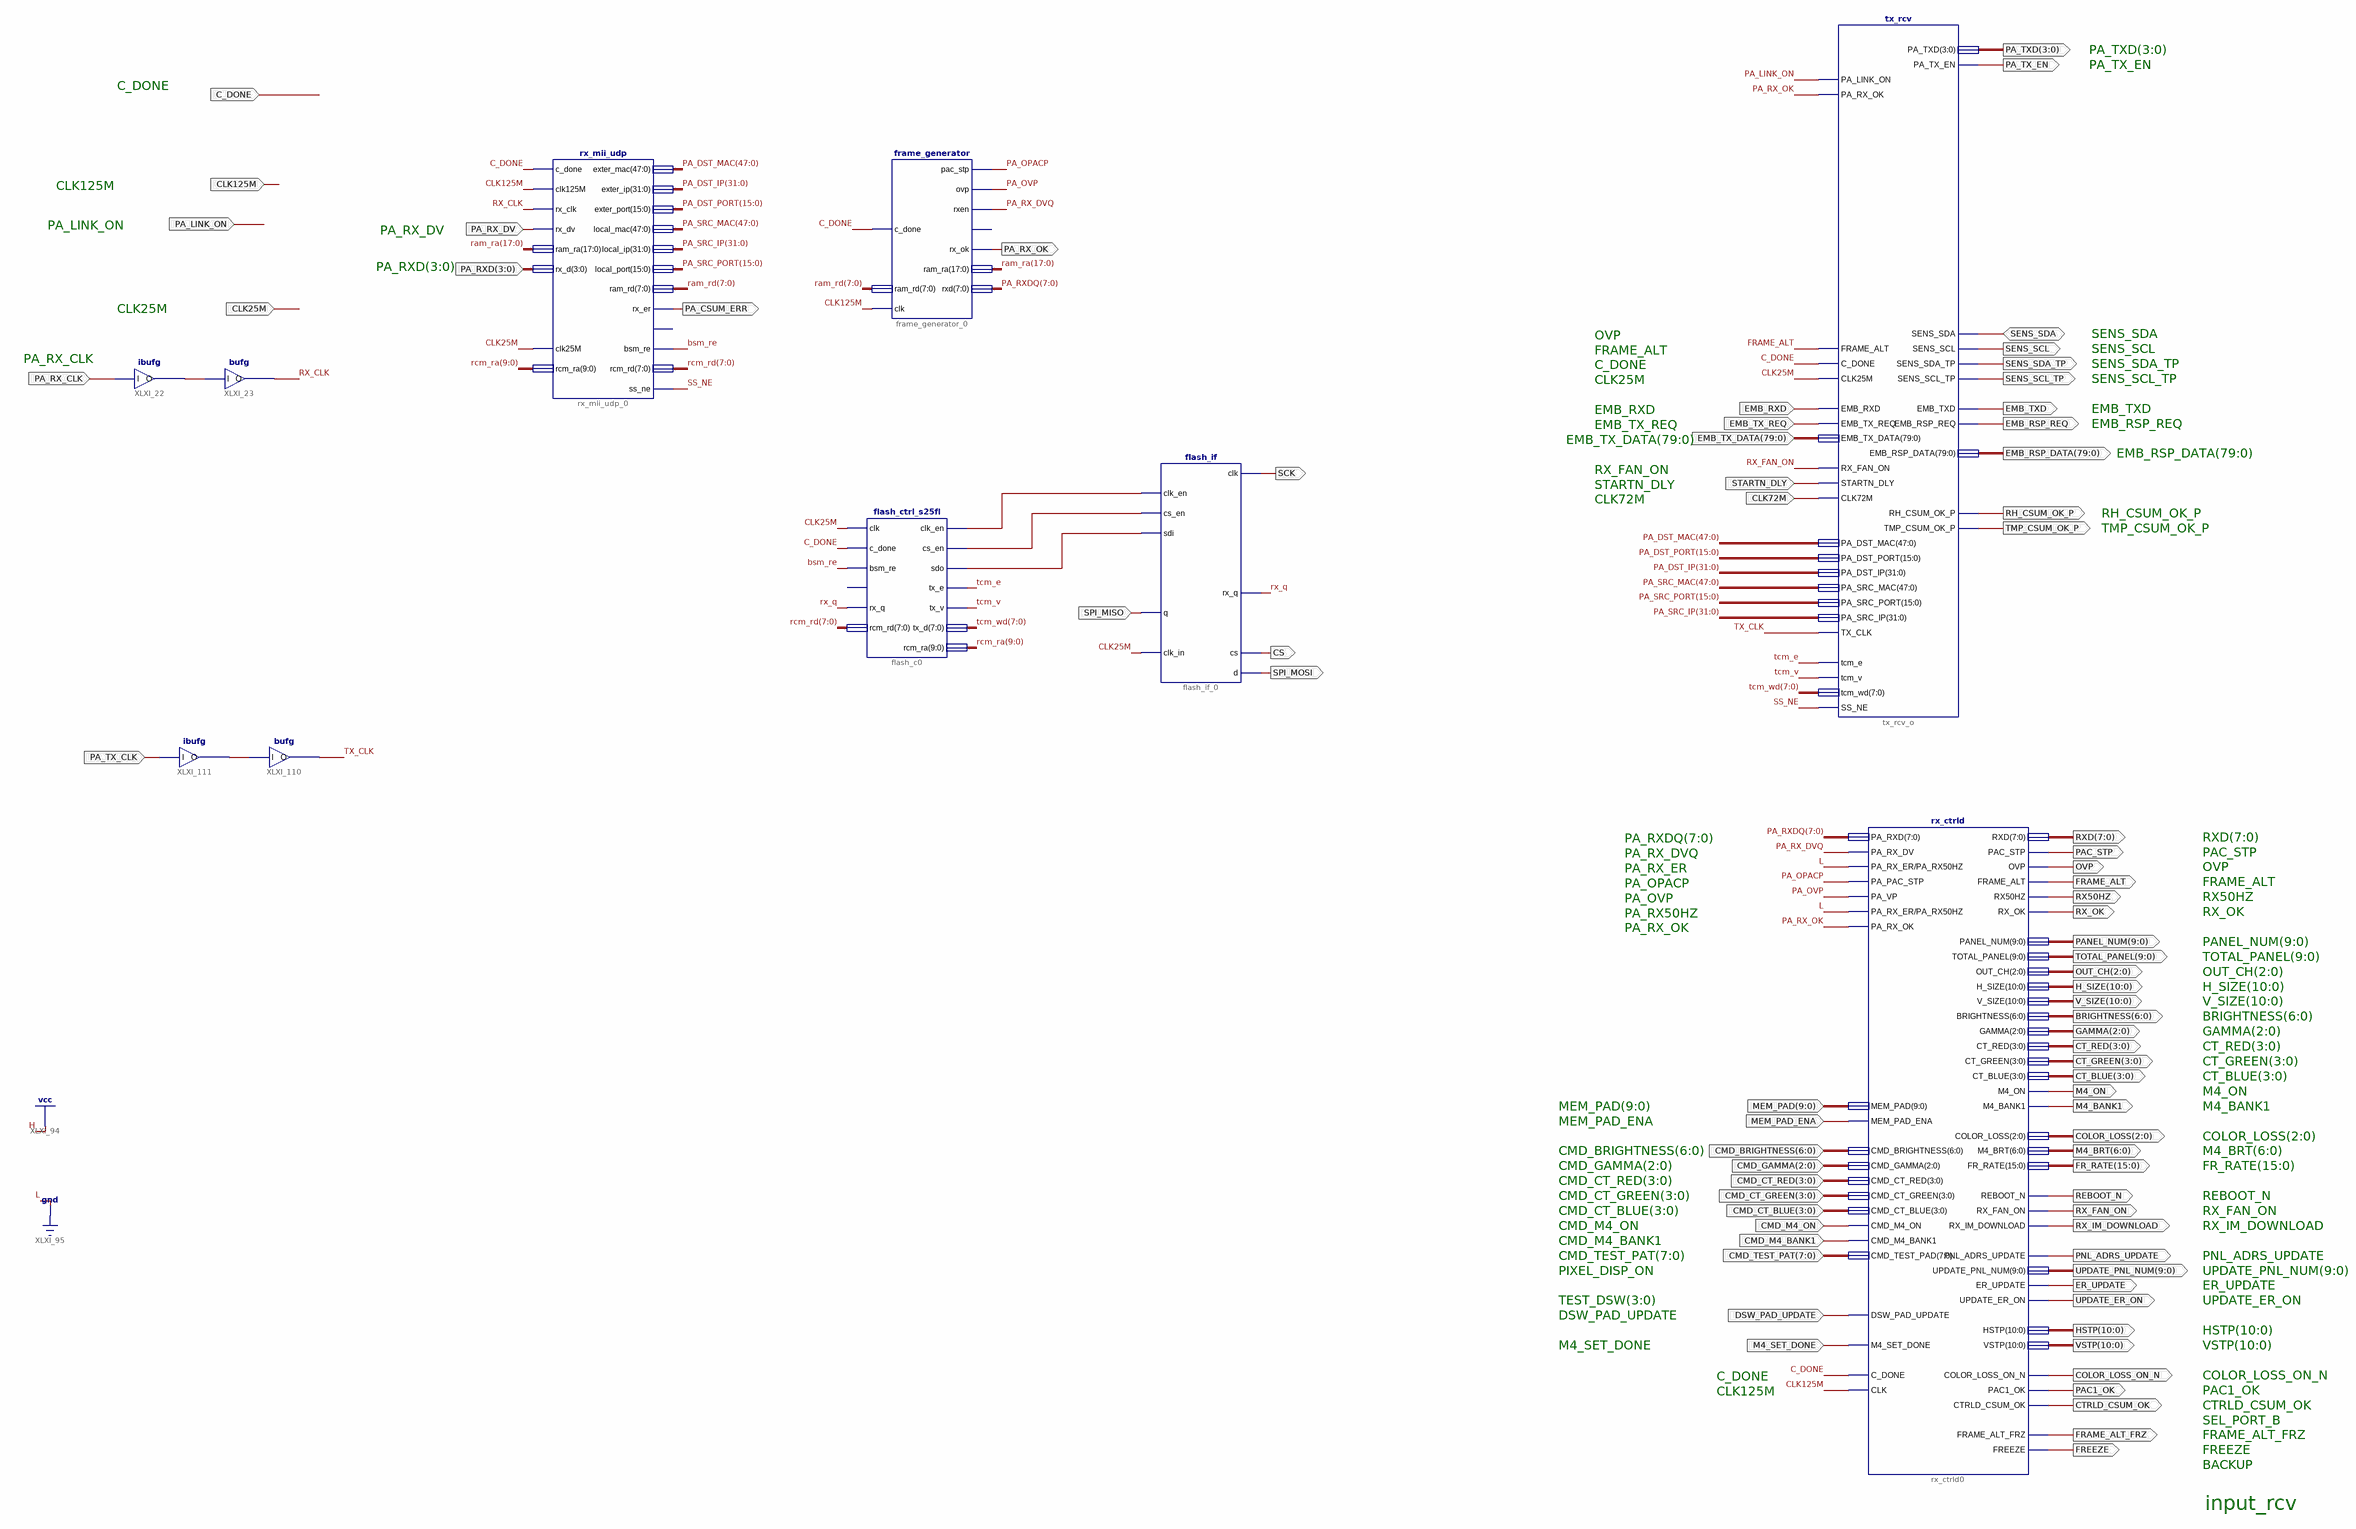
[diagram p0: schematic sheet 1]
// Xilinx ISE schematic input_rcv.sch (aspartan6) as structural Verilog: 10 symbols, 78 ports
module input_rcv (
  input  CLK125M,
  input  PA_LINK_ON,
  input  C_DONE,
  input  PA_RX_DV,
  input  CLK25M,
  input  EMB_RXD,
  input  EMB_TX_REQ,
  input  [79:0] EMB_TX_DATA,
  input  STARTN_DLY,
  input  CLK72M,
  input  [6:0] CMD_BRIGHTNESS,
  input  [9:0] MEM_PAD,
  input  MEM_PAD_ENA,
  input  [2:0] CMD_GAMMA,
  input  [3:0] CMD_CT_RED,
  input  [3:0] CMD_CT_GREEN,
  input  [3:0] CMD_CT_BLUE,
  input  CMD_M4_ON,
  input  CMD_M4_BANK1,
  input  [7:0] CMD_TEST_PAT,
  input  DSW_PAD_UPDATE,
  input  M4_SET_DONE,
  input  [3:0] PA_RXD,
  input  PA_RX_CLK,
  input  PA_TX_CLK,
  input  SPI_MISO,
  inout  SENS_SDA,
  output PA_RX_OK,
  output OVP,
  output [9:0] PANEL_NUM,
  output RX_FAN_ON,
  output FRAME_ALT,
  output [3:0] PA_TXD,
  output PA_TX_EN,
  output SENS_SCL_TP,
  output SENS_SDA_TP,
  output SENS_SCL,
  output EMB_TXD,
  output EMB_RSP_REQ,
  output [79:0] EMB_RSP_DATA,
  output TMP_CSUM_OK_P,
  output RH_CSUM_OK_P,
  output [7:0] RXD,
  output PAC_STP,
  output [9:0] UPDATE_PNL_NUM,
  output REBOOT_N,
  output RX_IM_DOWNLOAD,
  output PNL_ADRS_UPDATE,
  output ER_UPDATE,
  output UPDATE_ER_ON,
  output [10:0] HSTP,
  output [10:0] VSTP,
  output COLOR_LOSS_ON_N,
  output RX50HZ,
  output RX_OK,
  output PAC1_OK,
  output CTRLD_CSUM_OK,
  output [9:0] TOTAL_PANEL,
  output [2:0] OUT_CH,
  output [10:0] H_SIZE,
  output [10:0] V_SIZE,
  output [6:0] BRIGHTNESS,
  output [2:0] GAMMA,
  output [3:0] CT_RED,
  output [3:0] CT_GREEN,
  output [3:0] CT_BLUE,
  output M4_ON,
  output M4_BANK1,
  output [2:0] COLOR_LOSS,
  output [6:0] M4_BRT,
  output [15:0] FR_RATE,
  output FRAME_ALT_FRZ,
  output FREEZE,
  output L,
  output PA_CSUM_ERR,
  output SCK,
  output CS,
  output SPI_MOSI
);

  wire bsm_re, PA_OPACP, PA_OVP, PA_RX_DVQ, RX_CLK, rx_q, SS_NE, tcm_e, tcm_v, TX_CLK, XLXN_388, XLXN_691,
       XLXN_808, XLXN_831, XLXN_832;
  wire [7:0] PA_RXDQ, ram_rd, rcm_rd, tcm_wd;
  wire [9:0] rcm_ra;
  wire [15:0] PA_DST_PORT, PA_SRC_PORT;
  wire [17:0] ram_ra;
  wire [31:0] PA_DST_IP, PA_SRC_IP;
  wire [47:0] PA_DST_MAC, PA_SRC_MAC;

  tx_rcv tx_rcv_o (
    .PA_LINK_ON(PA_LINK_ON), .FRAME_ALT(FRAME_ALT), .C_DONE(C_DONE), .CLK25M(CLK25M),
    .EMB_TX_DATA(EMB_TX_DATA), .EMB_RXD(EMB_RXD), .EMB_TX_REQ(EMB_TX_REQ), .RX_FAN_ON(RX_FAN_ON),
    .STARTN_DLY(STARTN_DLY), .CLK72M(CLK72M), .PA_DST_MAC(PA_DST_MAC), .PA_DST_PORT(PA_DST_PORT),
    .PA_DST_IP(PA_DST_IP), .PA_SRC_MAC(PA_SRC_MAC), .PA_SRC_PORT(PA_SRC_PORT), .PA_SRC_IP(PA_SRC_IP),
    .PA_RX_OK(PA_RX_OK), .TX_CLK(TX_CLK), .tcm_e(tcm_e), .tcm_v(tcm_v), .tcm_wd(tcm_wd), .SENS_SDA(SENS_SDA),
    .PA_TXD(PA_TXD), .PA_TX_EN(PA_TX_EN), .SENS_SCL_TP(SENS_SCL_TP), .SENS_SCL(SENS_SCL),
    .SENS_SDA_TP(SENS_SDA_TP), .EMB_RSP_DATA(EMB_RSP_DATA), .EMB_RSP_REQ(EMB_RSP_REQ), .EMB_TXD(EMB_TXD),
    .RH_CSUM_OK_P(RH_CSUM_OK_P), .TMP_CSUM_OK_P(TMP_CSUM_OK_P), .SS_NE(SS_NE));
  rx_ctrld rx_ctrld0 (
    .CLK(CLK125M), .PA_RXD(PA_RXDQ), .C_DONE(C_DONE), .CMD_BRIGHTNESS(CMD_BRIGHTNESS), .CMD_GAMMA(CMD_GAMMA),
    .CMD_CT_RED(CMD_CT_RED), .CMD_CT_GREEN(CMD_CT_GREEN), .CMD_CT_BLUE(CMD_CT_BLUE),
    .CMD_TEST_PAD(CMD_TEST_PAT), .DSW_PAD_UPDATE(DSW_PAD_UPDATE), .CMD_M4_BANK1(CMD_M4_BANK1),
    .CMD_M4_ON(CMD_M4_ON), .MEM_PAD_ENA(MEM_PAD_ENA), .M4_SET_DONE(M4_SET_DONE), .PA_RX_DV(PA_RX_DVQ),
    .PA_RX_ER(1'b0), .PA_PAC_STP(PA_OPACP), .PA_VP(PA_OVP), .PA_RX50HZ(1'b0), .PA_RX_OK(PA_RX_OK),
    .MEM_PAD(MEM_PAD), .RX_OK(RX_OK), .OVP(OVP), .PAC_STP(PAC_STP), .RXD(RXD), .PANEL_NUM(PANEL_NUM),
    .TOTAL_PANEL(TOTAL_PANEL), .OUT_CH(OUT_CH), .H_SIZE(H_SIZE), .V_SIZE(V_SIZE), .BRIGHTNESS(BRIGHTNESS),
    .GAMMA(GAMMA), .CT_RED(CT_RED), .CT_GREEN(CT_GREEN), .CT_BLUE(CT_BLUE), .M4_ON(M4_ON),
    .M4_BANK1(M4_BANK1), .COLOR_LOSS(COLOR_LOSS), .M4_BRT(M4_BRT), .RX50HZ(RX50HZ), .FRAME_ALT(FRAME_ALT),
    .UPDATE_PNL_NUM(UPDATE_PNL_NUM), .REBOOT_N(REBOOT_N), .RX_FAN_ON(RX_FAN_ON),
    .RX_IM_DOWNLOAD(RX_IM_DOWNLOAD), .PNL_ADRS_UPDATE(PNL_ADRS_UPDATE), .ER_UPDATE(ER_UPDATE),
    .UPDATE_ER_ON(UPDATE_ER_ON), .HSTP(HSTP), .VSTP(VSTP), .COLOR_LOSS_ON_N(COLOR_LOSS_ON_N),
    .PAC1_OK(PAC1_OK), .CTRLD_CSUM_OK(CTRLD_CSUM_OK), .FR_RATE(FR_RATE), .FRAME_ALT_FRZ(FRAME_ALT_FRZ),
    .FREEZE(FREEZE));
  frame_generator frame_generator_0 (
    .c_done(C_DONE), .ram_rd(ram_rd), .pac_stp(PA_OPACP), .ovp(PA_OVP), .rxen(PA_RX_DVQ), .rx_ok(PA_RX_OK),
    .ram_ra(ram_ra), .rxd(PA_RXDQ), .clk(CLK125M));  // open: rxerr
  rx_mii_udp rx_mii_udp_0 (
    .c_done(C_DONE), .clk125M(CLK125M), .clk25M(CLK25M), .rx_clk(RX_CLK), .rx_dv(PA_RX_DV), .ram_ra(ram_ra),
    .rcm_ra(rcm_ra), .rx_d(PA_RXD), .rx_er(PA_CSUM_ERR), .bsm_re(bsm_re), .exter_mac(PA_DST_MAC),
    .exter_ip(PA_DST_IP), .exter_port(PA_DST_PORT), .local_mac(PA_SRC_MAC), .local_ip(PA_SRC_IP),
    .local_port(PA_SRC_PORT), .ram_rd(ram_rd), .rcm_rd(rcm_rd), .ss_ne(SS_NE));  // open: pac_err
  bufg XLXI_23 (.I(XLXN_388), .O(RX_CLK));
  ibufg XLXI_22 (.I(PA_RX_CLK), .O(XLXN_388));
  bufg XLXI_110 (.I(XLXN_808), .O(TX_CLK));
  ibufg XLXI_111 (.I(PA_TX_CLK), .O(XLXN_808));
  flash_ctrl_s25fl flash_c0 (
    .bsm_re(bsm_re), .clk(CLK25M), .clk_en(XLXN_831), .cs_en(XLXN_832), .c_done(C_DONE), .rcm_ra(rcm_ra),
    .rcm_rd(rcm_rd), .rx_q(rx_q), .sdo(XLXN_691), .tx_d(tcm_wd), .tx_e(tcm_e), .tx_v(tcm_v));  // open: frame_alt
  flash_if flash_if_0 (
    .sdi(XLXN_691), .clk_en(XLXN_831), .cs_en(XLXN_832), .q(SPI_MISO), .clk(SCK), .rx_q(rx_q),
    .clk_in(CLK25M), .cs(CS), .d(SPI_MOSI));

  assign L = 1'b0;

  // Notes on the sheet:
  //   PA_TXD(3:0)
  //   PA_TX_EN
  //   C_DONE
  //   CLK125M
  //   PA_LINK_ON
  //   PA_RX_DV
  //   PA_RXD(3:0)
  //   CLK25M
  //   SENS_SDA
  //   OVP
  //   SENS_SCL
  //   FRAME_ALT
  //   PA_RX_CLK
  //   SENS_SDA_TP
  //   C_DONE
  //   SENS_SCL_TP
  //   CLK25M
  //   EMB_TXD
  //   EMB_RXD
  //   EMB_RSP_REQ
  //   EMB_TX_REQ
  //   EMB_TX_DATA(79:0)
  //   EMB_RSP_DATA(79:0)
  //   RX_FAN_ON
  //   STARTN_DLY
  //   CLK72M
  //   RH_CSUM_OK_P
  //   TMP_CSUM_OK_P
  //   RXD(7:0)
  //   PA_RXDQ(7:0)
  //   PAC_STP
  //   PA_RX_DVQ
  //   OVP
  //   PA_RX_ER
  //   FRAME_ALT
  //   PA_OPACP
  //   RX50HZ
  //   PA_OVP
  //   RX_OK
  //   PA_RX50HZ
  //   PA_RX_OK
  //   PANEL_NUM(9:0)
  //   TOTAL_PANEL(9:0)
  //   OUT_CH(2:0)
  //   H_SIZE(10:0)
  //   V_SIZE(10:0)
  //   BRIGHTNESS(6:0)
  //   GAMMA(2:0)
  //   CT_RED(3:0)
  //   CT_GREEN(3:0)
  //   CT_BLUE(3:0)
  //   M4_ON
  //   MEM_PAD(9:0)
  //   M4_BANK1
  //   MEM_PAD_ENA
  //   COLOR_LOSS(2:0)
  //   CMD_BRIGHTNESS(6:0)
  //   M4_BRT(6:0)
  //   CMD_GAMMA(2:0)
  //   FR_RATE(15:0)
  //   CMD_CT_RED(3:0)
  //   CMD_CT_GREEN(3:0)
  //   REBOOT_N
  //   CMD_CT_BLUE(3:0)
  //   RX_FAN_ON
  //   CMD_M4_ON
  //   RX_IM_DOWNLOAD
  //   CMD_M4_BANK1
  //   CMD_TEST_PAT(7:0)
  //   PNL_ADRS_UPDATE
  //   PIXEL_DISP_ON
  //   UPDATE_PNL_NUM(9:0)
  //   ER_UPDATE
  //   TEST_DSW(3:0)
  //   UPDATE_ER_ON
  //   DSW_PAD_UPDATE
  //   HSTP(10:0)
  //   M4_SET_DONE
  //   VSTP(10:0)
  //   COLOR_LOSS_ON_N
  //   C_DONE
  //   PAC1_OK
  //   CLK125M
  //   CTRLD_CSUM_OK
  //   SEL_PORT_B
  //   FRAME_ALT_FRZ
  //   FREEZE
  //   BACKUP
  //   input_rcv
endmodule
